# Altium schematic sheet Ext USB ver1.SchDoc
size A
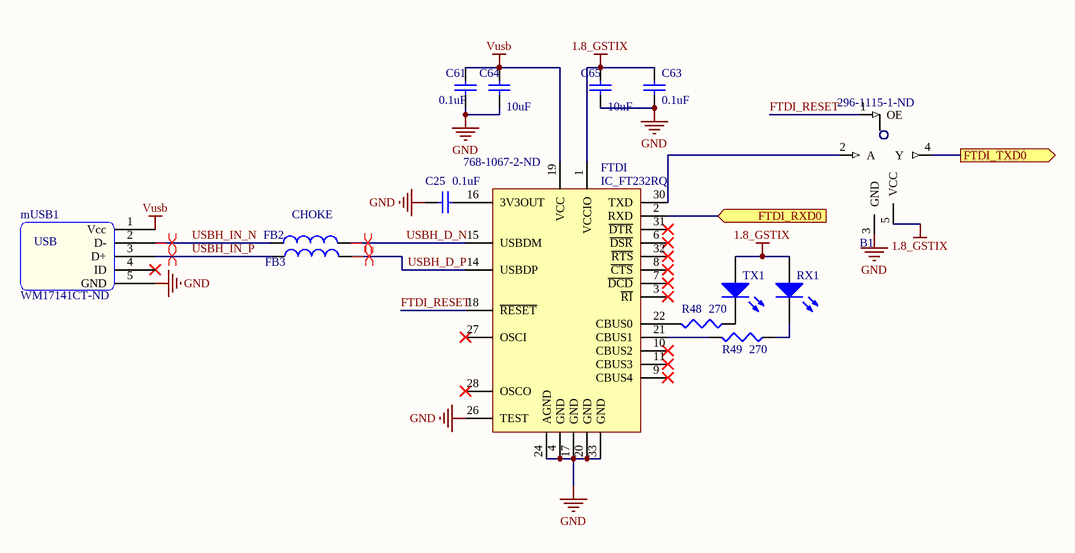
[diagram p0: Ext USB ver1.SchDoc]

## Parts
B1  Supplier Part Number 1: 296-1115-1-ND  [SOT95P280X145-5N]  (hidden comment: single tristate output line buffer)
C25  value 0.1uF  [0603_CAP]
C61  value 0.1uF  [0603_CAP]
C63  value 0.1uF  [0603_CAP]
C64  value 10uF  [0603_CAP]
C65  value 10uF  [0603_CAP]
FB2  CHOKE  [INDC1608L]  (value not drawn)
FB3  CHOKE  [INDC1608L]
FTDI  IC_FT232RQ  Supplier Part Number 1: 768-1067-2-ND  [QFN-32]
mUSB1  microUSB  [microUSB]  (value not drawn)
R48  value 270  [0603_Res]  (hidden comment: Rpull)
R49  value 270  [0603_Res]  (hidden comment: Rpull)
RX1  LED0  [0603_RES]  (value not drawn)
TX1  LED0  [0603_RES]  (value not drawn)

## Ports
FTDI_RXD0 (in), FTDI_TXD0 (out)

## Nets
1.8_GSTIX: B1.5(VCC) C63.2 C65.1 FTDI.1(VCCIO) RX1.1(A) TX1.1(A)
GND: B1.3(GND) C25.2 C61.2 C63.1 C64.2 C65.2 FTDI.4(GND) FTDI.17(GND) FTDI.20(GND) FTDI.24(AGND) FTDI.26(TEST) FTDI.33(GND) mUSB1.5(GND)
NC: FTDI.5(NC) FTDI.12(NC) FTDI.13(NC) FTDI.23(NC) FTDI.25(NC) FTDI.29(NC)
Vusb: C61.1 C64.1 FTDI.19(VCC) mUSB1.1(Vcc)
FTDI_RESET: B1.1(OE) FTDI.18(~{RESET})
FTDI_RXD0: FTDI.2(RXD) ; port FTDI_RXD0
FTDI_TXD0: B1.4(Y) ; port FTDI_TXD0
USBH_D_N: FB2.2 FTDI.15(USBDM)
USBH_D_P: FB3.2 FTDI.14(USBDP)
USBH_IN_N: FB2.1 mUSB1.2(D-)
USBH_IN_P: FB3.1 mUSB1.3(D+)
NetB1_2: B1.2(A) FTDI.30(TXD)
NetC25_1: C25.1 FTDI.16(3V3OUT)
NetFTDI_21: FTDI.21(CBUS1) R49.2
NetFTDI_22: FTDI.22(CBUS0) R48.2
NetR48_1: R48.1 TX1.2(K)
NetR49_1: R49.1 RX1.2(K)

Not connected (* = marked no-connect by the designer): FTDI 3(~{RI})* 6(~{DSR})* 7(~{DCD})* 8(~{CTS})* 9(CBUS4)* 10(CBUS2)* 11(CBUS3)* 27(OSCI)* 28(OSCO)* 31(~{DTR})* 32(~{RTS})*; mUSB1 4(ID)*

## Layout directives
differential pair: USBH_D_N, USBH_D_P, USBH_IN_N, USBH_IN_P

## Notes on the sheet
- (in symbol microUSB) USB

## Library data of the parts
B1 = 74AHC1G126DCK: 296-8747-1-ND; Manufacturer: Texas Instruments; Manufacturer Part Number: SN74AHCT1G32DBVR; Description: IC SGL 2IN POS-OR GATE SOT23-5; Logic Type: OR Gate; Number of Inputs: 2; Number of Circuits: 1; Current - Output High, Low: 8mA, 8mA; Voltage - Supply: 4.5 V ~ 5.5 V; Supplier 1: Digi-Key; RoHS: RoHS Compliant; Category: Integrated Circuits (ICs); Stock 1: 12354; Pricing 1: 1=0.42, 25=0.2372, 100=0.18, 250=0.12752, 500=0.102, 1000=0.078 (USD); Operating Temperature: -40°C ~ 85°C; Mounting Type: Surface Mount; Package / Case: SC-74A, SOT-753; Supplier Device Package: SOT-23-5; Packaging: Cut Tape (CT); ComponentLink1URL: http://www.ti.com/lit/ds/symlink/sn74ahct1g32.pdf; ComponentLink1Description: http://www.ti.com/lit/ds/symlink/sn74ahct1g32.pdf
C25 C61 C63-C65 = Cap: Capacitor; Published: 8-Jun-2000; LatestRevisionDate: 17-Jul-2002; LatestRevisionNote: Re-released for DXP Platform.; PackageReference: RAD-0.3; Publisher: Altium Limited
FB2 FB3 = Inductor: Manufacturer: Taiyo Yuden; Manufacturer Part Number: BK1608HS220-T; Code_IEC: 1005; Description: FERRITE BEAD 22 OHM 0603; Impedance @ Frequency: 22 Ohm @ 100MHz; Current Rating: 1.5A; DC Resistance (DCR): 50 mOhm Max; Filter Type: Differential Mode - Single; Number of Lines: 1; Published: 8-Jun-2000; LatestRevisionDate: 29-May-2009; LatestRevisionNote: IPC-7351 Footprint Added.; PackageReference: 0402-A; Publisher: Altium Limited; PackageDescription: Chip Inductor; Code_JEITA: 0402; Supplier 1: Digi-Key; Supplier Part Number 1: 587-1869-1-ND; RoHS: RoHS Compliant; Category: Filters; Stock 1: 27225; Pricing 1: 1=0.33, 10=0.22, 50=0.1142, 100=0.088, 250=0.06324, 500=0.0451, 1000=0.033 (USD); Package / Case: 0603 (1608 Metric); Mounting Type: Surface Mount; Packaging: Cut Tape (CT); Height (Max): 0.037" (0.95mm); Size / Dimension: 0.063" L x 0.031" W (1.60mm x 0.80mm); ComponentLink1URL: http://www.yuden.co.jp/us/product/pdf/mlci07_e.pdf; ComponentLink1Description: http://www.yuden.co.jp/us/product/pdf/mlci07_e.pdf
FTDI = IC_FT232RQ: FT232R USB UART; Manufacturer Part Number: FT232BQ-REEL; Description: IC NEW DESIGNS REFER TO FT232RQ; Number of Channels: 1, UART; FIFO's: 256 Byte; Protocol: RS-232, RS-422, RS-485; Voltage - Supply: 4.35 V ~ 5.25 V; With Auto Flow Control: Yes; Manufacturer: *; Note: *; ManufacturerPartNo: *; Supplier 1: Digi-Key; RoHS: RoHS Compliant; Category: Integrated Circuits (ICs); Stock 1: 2500; Pricing 1: 2500=3.00001, 5000=2.9375 (USD); Features: -; With Parallel Port: -; With IrDA Encoder/Decoder: -; With False Start Bit Detection: -; With Modem Control: Yes; With CMOS: Yes; Mounting Type: Surface Mount; Package / Case: 32-WFQFN Exposed Pad; Supplier Device Package: 32-QFN Exposed Pad (5x5); Packaging: Tape & Reel (TR); ComponentLink1URL: http://www.ftdichip.com/Support/Documents/DataSheets/ICs/DS_FT232BL_BQ.pdf; ComponentLink1Description: http://www.ftdichip.com/Support/Documents/DataSheets/ICs/DS_FT232BL_BQ.pdf
mUSB1 = microUSB: WM17141CT-ND; Manufacturer: Molex Inc; Manufacturer Part Number: 47346-0001; Description: CONN RCPT 5POS MICRO USB R/A; Connector Type: USB - micro B; Number of Contacts: 5; Gender: Receptacle; Impedance @ Frequency: 22 Ohm @ 100MHz; Current Rating: 1.5A; DC Resistance (DCR): 50 mOhm Max; Filter Type: Differential Mode - Single; Number of Lines: 1; Supplier 1: Digi-Key; RoHS: RoHS Compliant; Category: Connectors, Interconnects; Stock 1: 13846; Pricing 1: 1=1.31, 10=1.016, 50=0.8594, 100=0.775, 250=0.65312, 500=0.61876, 1000=0.55 (USD); Specifications: -; Mounting Type: Surface Mount, Right Angle, Horizontal; Features: Shielded; Packaging: Cut Tape (CT); Ingress Protection: -; ComponentLink1URL: http://www.molex.com/pdm_docs/sd/473460001_sd.pdf; ComponentLink1Description: http://www.molex.com/pdm_docs/sd/473460001_sd.pdf; Supplier Part Number 1: WM17141CT-ND; Supplier 2: Digi-Key; Supplier Part Number 2: 587-1869-1-ND; Stock 2: 27225; Pricing 2: 1=0.33, 10=0.22, 50=0.1142, 100=0.088, 250=0.06324, 500=0.0451, 1000=0.033 (USD); Package / Case: 0603 (1608 Metric); Height (Max): 0.037" (0.95mm); Size / Dimension: 0.063" L x 0.031" W (1.60mm x 0.80mm); ComponentLink2URL: http://www.yuden.co.jp/us/product/pdf/mlci07_e.pdf; ComponentLink2Description: http://www.yuden.co.jp/us/product/pdf/mlci07_e.pdf
R48 R49 = Rpull: Resistor; Published: 8-Jun-2000; LatestRevisionDate: 29-May-2009; LatestRevisionNote: IPC-7351 Footprint Added.; PackageReference: J1-0603; Publisher: Altium Limited; PackageDescription: Chip Resistor
RX1 TX1 = LED0: Typical INFRARED GaAs LED; Published: 8-Jun-2000; LatestRevisionDate: 08-Jul-2005; LatestRevisionNote: Mech Layer 1 removed.; PackageReference: LED-0; Publisher: Altium Limited